# EAGLE design PiPowerV1 (EAGLE 6.4)
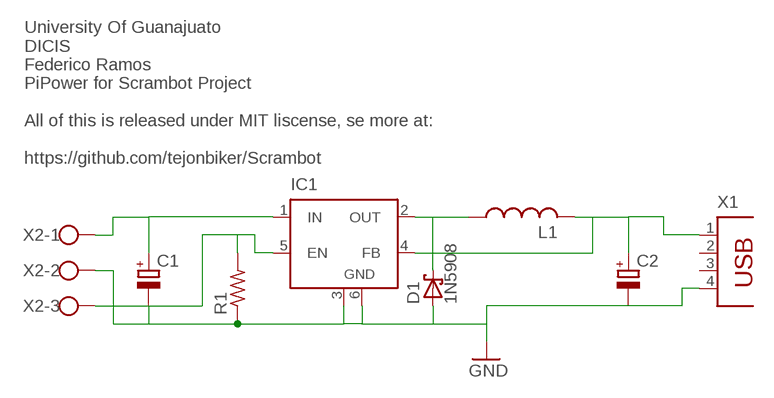
[diagram p0: schematic, sheet 1]

## Parts
C1  CPOL-EUE3.5-10  [E3,5-10]
C2  CPOL-EUE3.5-10  [E3,5-10]
D1  1N5908  [C4111-15]
IC1  LM2596S  [TO263-5]
L1  L-US0204/5  [0204/5]
R1  R-US_M1206  [M1206]
X1  PN87520  [PN87520]
X2  W237-103  [W237-103]

## Nets
N$1: C2.+ IC1.4(FB) L1.2 X1.1
N$3: C1.+ IC1.1(IN) X2.1
N$4: IC1.5(EN) R1.2 X2.3
N$5: D1.C IC1.2(OUT) L1.1
N$6: C1.- C2.- D1.A IC1.3(GND) IC1.6(GND) R1.1 X1.4 X2.2 ; supply symbol labelled GND
Unconnected: X1.2 X1.3

## Notes on the sheet
- University Of Guanajuato
  DICIS
  Federico Ramos
  PiPower for Scrambot Project
  
  All of this is released under MIT liscense, se more at:
  
  https://github.com/tejonbiker/Scrambot

## Library data of the parts
C1 C2 = rcl:CPOL-EU: POLARIZED CAPACITOR, European symbol
D1 = diode:1N5908: DIODE schottky
IC1 = linear:LM2596S: STEP-DOWN VOLTAGE REGULATOR
L1 = rcl:L-US: INDUCTOR, American symbol
R1 = rcl:R-US_: RESISTOR, American symbol
X1 = con-berg:PN87520: BERG USB connector; OC_FARNELL: unknown; OC_NEWARK: unknown
X2 = con-wago-500:W237-103: WAGO SCREW CLAMP; MPN: 237-103; OC_FARNELL: unknown; OC_NEWARK: 18M7116

## Board
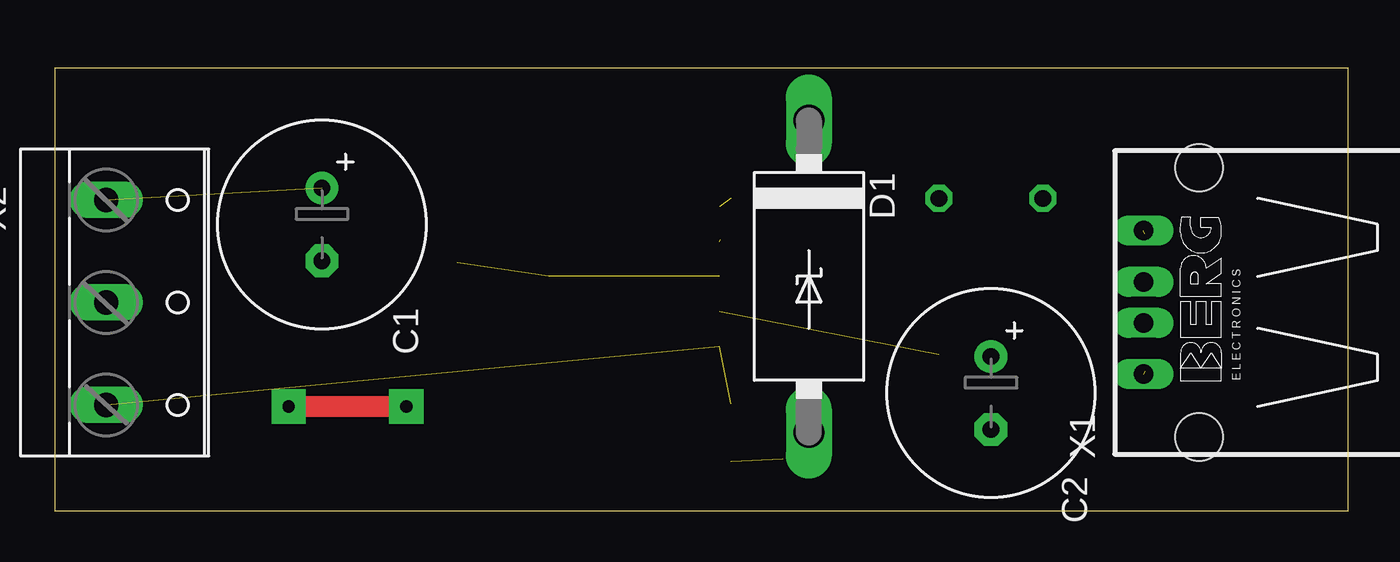
[diagram p1: board, top side]
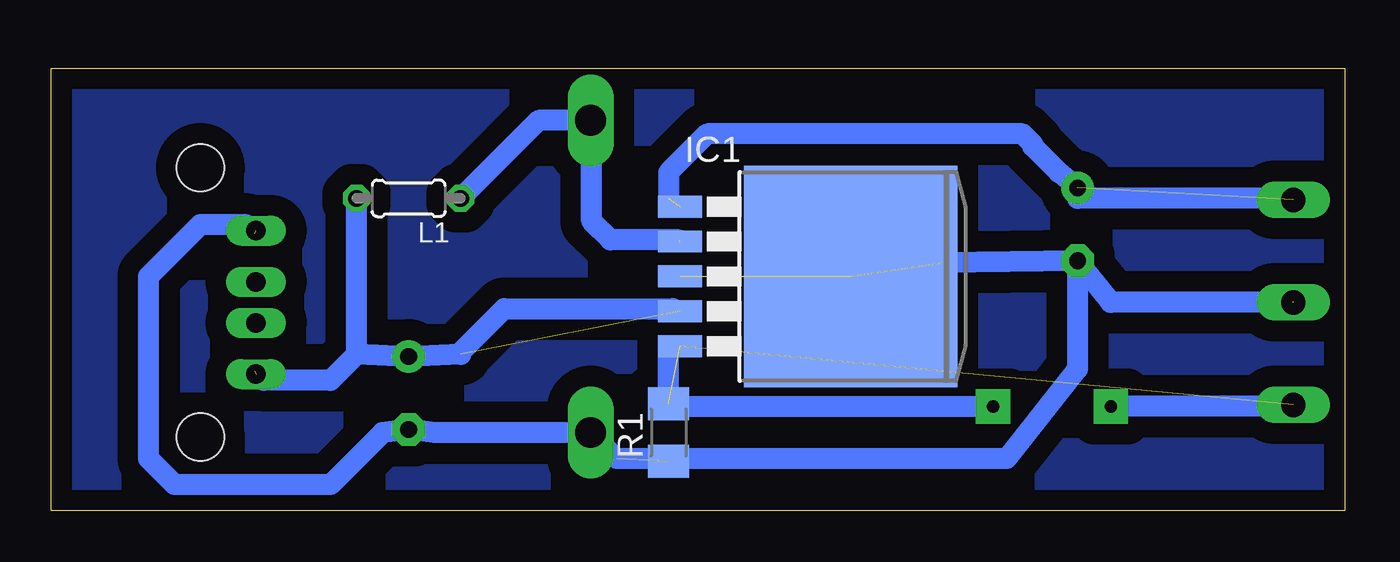
[diagram p2: board, bottom side, seen from below]

Size 63.17 x 21.58 mm. Coordinates in mm from the lower left corner, seen from the top.
Outline: 0,0 63.17,0 63.17,21.58 0,21.58 0,0
Copper layers (1*16): Top 0.035mm / dielectric 1.5mm / Bottom 0.035mm
Design rules "default": minimum track width 10mil, minimum drill 24mil, track to track 8mil, track to pad 8mil, pad to pad 8mil, via to via 8mil, smd to smd 8mil, copper to edge 40mil, drill to drill 8mil, minimum pad ring 10mil, minimum via ring 8mil, stop-mask expansion 4mil, vias tented up to drill 0mil, thermal gap 10mil

### Footprints (pad centres in the part's own frame; a part is rotated, then mirrored left to right if it is on the bottom)
E3,5-10 = drill 0.813 pad 1.6: + -1.778,0 | drill 0.813 pad 1.6 octagon: - 1.778,0
C4111-15 = drill 1.499 long: A 7.62,0; C -7.62,0
TO263-5 = smd 1.067 x 2.159: 1 -3.404,-5.791; 2 -1.702,-5.791; 3 0,-5.791; 4 1.702,-5.791; 5 3.404,-5.791 | smd 10.8 x 10.41: 6 0,2.54
0204/5 = drill 0.813 octagon: 1 -2.54,0; 2 2.54,0
M1206 = smd 1.6 x 2: 1 -1.4,0; 2 1.4,0
PN87520 = drill 0.95 long: 1 -3.5,2.71; 2 -1,2.71; 3 1,2.71; 4 3.5,2.71 | hole 2.3: -6.57,0; 6.57,0
W237-103 = drill 1.194 long: 1 -5,-1.29; 2 0,-1.29; 3 5,-1.29

### Placement (x,y rotation side)
C1  13.06,13.97 270 top
C2  45.72,5.74 270 top
D1  36.83,11.43 270 top
IC1  26.67,11.43 270 bottom
L1  45.72,15.24 180 bottom
R1  33.02,3.81 90 bottom
X1  55.88,10.16 90 top
X2  3.81,10.16 270 top

### Tracks (layer width: path | path; a pad name or v marks a point on that pad's centre or on a via)
N$1  (2 unrouted)
  Bottom 1.016: 48.26,7.62 C2.+ 43.18,7.62 | 48.26,7.62 L1.2 | 48.26,7.62 49.53,6.35 52.78,6.35 53.24,6.81
N$2
  Bottom 1.016: 43.18,7.72 41.05,9.86 32.82,9.86
N$3  (2 unrouted)
  Bottom 1.016: C1.+ 13.97,16.51 15.24,17.78 15.24,17.88 15.75,18.39 31.14,18.39 33.02,16.51 33.02,15.24
N$4  (2 unrouted)
N$5  (1 unrouted)
  Bottom 1.016: 32.51,13.21 35.87,13.21 36.78,14.12 36.78,19 D1.C 39.37,19.05 L1.1
N$6  (5 unrouted)
  Bottom 1.016: 2.54,10.16 11.43,10.16 C1.- | C1.- 19.66,12.09 | C1.- 13.06,6.91 16.51,2.54 35.56,2.54 D1.A 44.45,3.81 C2.- 46.99,3.81 49.53,1.27 57.15,1.27 58.42,2.54 58.42,11.43 55.88,13.97 53.7,13.97 53.24,13.51
N$7
  pour Bottom (isolate 1.016): 0,21.59 0,0 63.5,0 63.5,21.59
N$8
  Bottom 1.016: 17.22,5.08 33.02,5.08 33.02,7.62
N$9  (via drill 0.6 pad 1.68)
  Top 1.016: v11.43,5.08 v17.17,5.08
  Bottom 1.016: 2.54,5.08 v11.43,5.08
N$10
  Bottom 1.016: 2.54,15.24 13.06,15.24